# EAGLE design PSU Board (EAGLE 9.0.1)
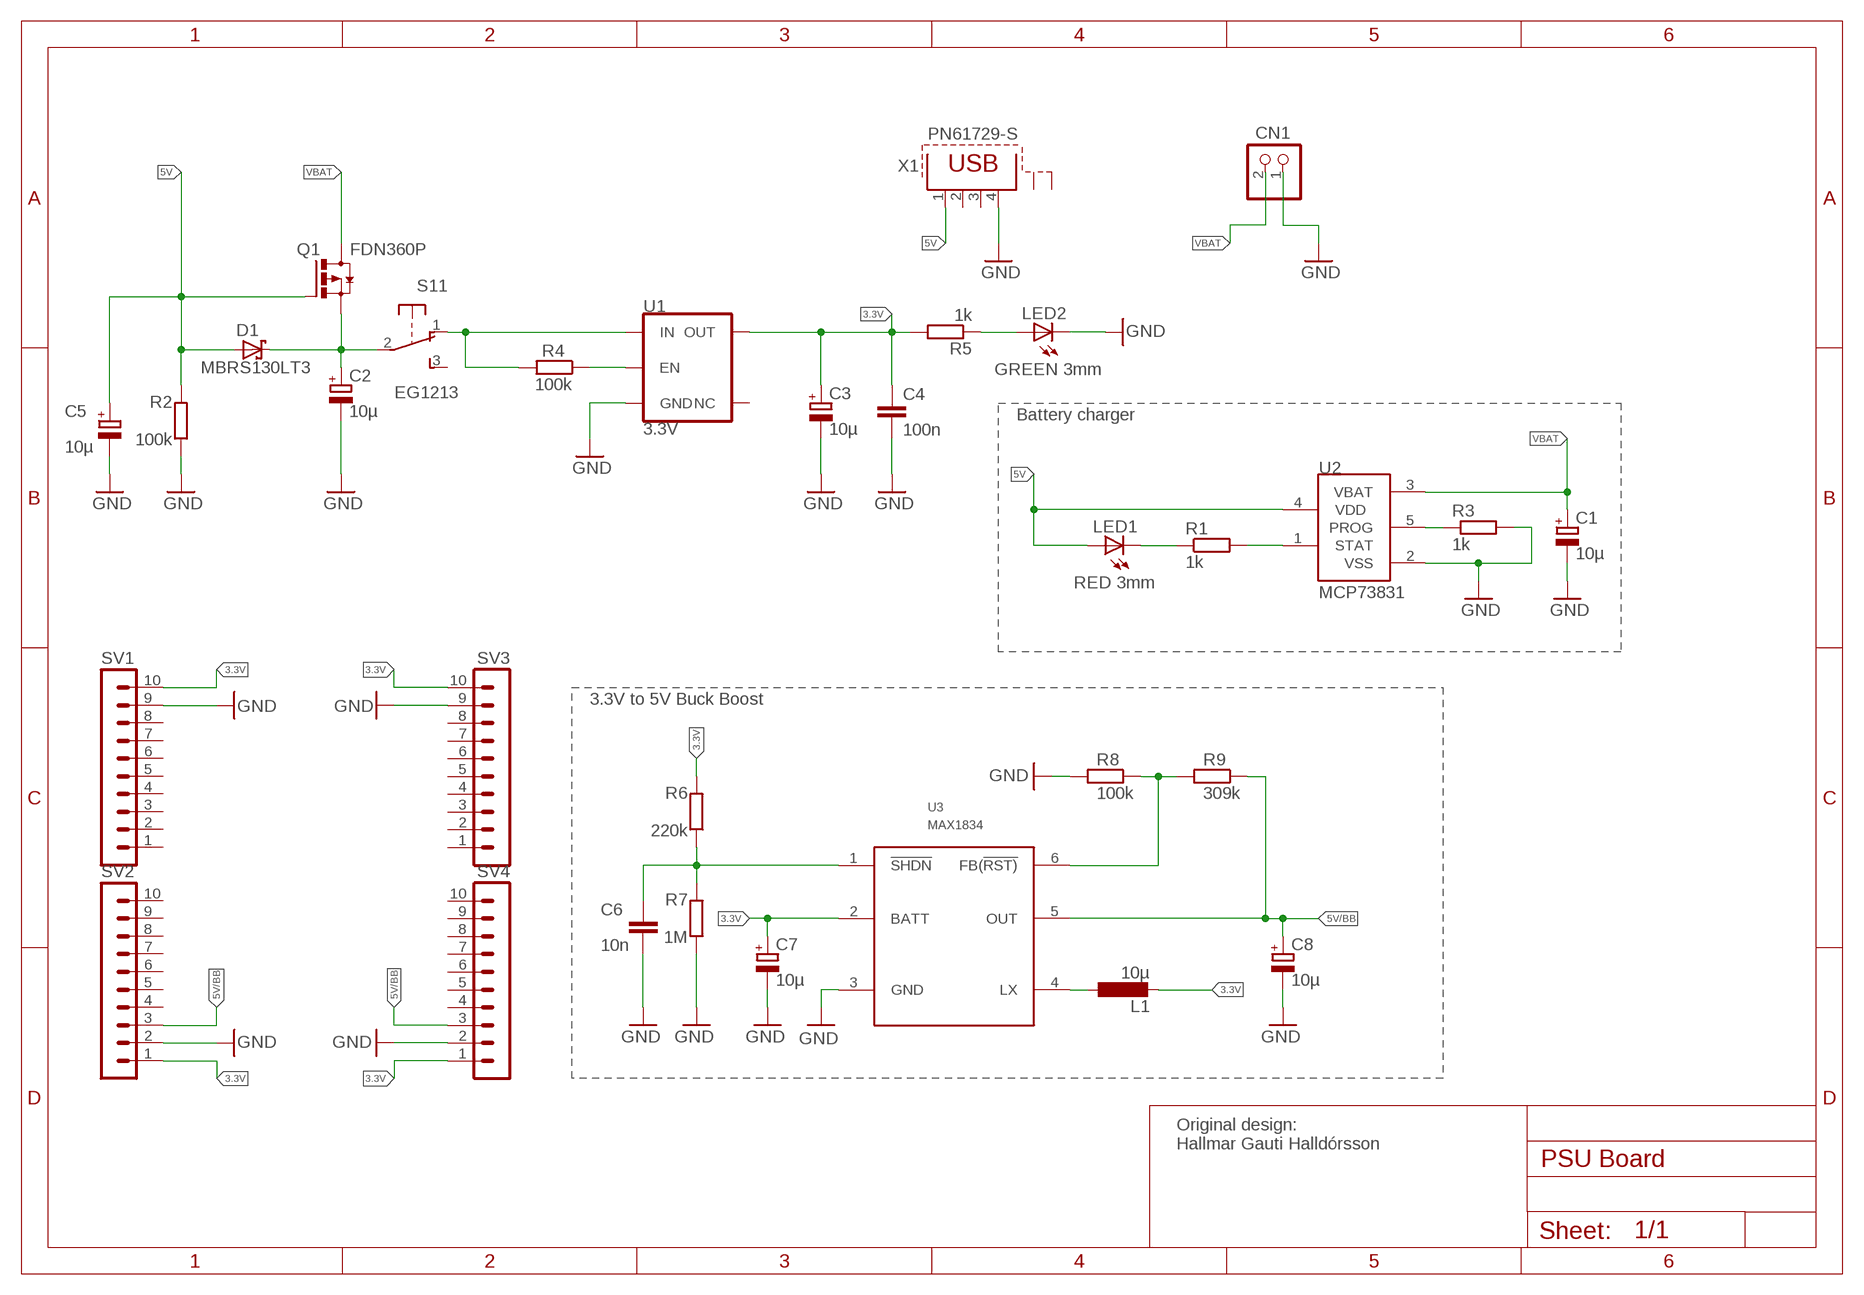
[diagram p0: schematic, sheet 1]

## Parts
C1  10µ  CPOL-EU140CLH-0810  [140CLH-0810]
C2  10µ  CPOL-EU140CLH-0810  [140CLH-0810]
C3  10µ  CPOL-EU140CLH-0810  [140CLH-0810]
C4  100n  C-EUC1206  [C1206]
C5  10µ  CPOL-EU140CLH-0810  [140CLH-0810]
C6  10n  C-EUC1206  [C1206]
C7  10µ  CPOL-EU140CLH-0810  [140CLH-0810]
C8  10µ  CPOL-EU140CLH-0810  [140CLH-0810]
CN1  JST_2PIN-SMT  [JST-PH-2-SMT]
D1  MBRS130LT3  [SMB]
L1  10µ  L-EUL3216C  [L3216C]
LED1  RED 3mm  LED3MM  [LED3MM]
LED2  GREEN 3mm  LED3MM  [LED3MM]
Q1  FDN360P  [SUPER-SOT3]
R1  1k  R-EU_M1206  [M1206]
R2  100k  R-EU_M1206  [M1206]
R3  1k  R-EU_M1206  [M1206]
R4  100k  R-EU_M1206  [M1206]
R5  1k  R-EU_M1206  [M1206]
R6  220k  R-EU_M1206  [M1206]
R7  1M  R-EU_M1206  [M1206]
R8  100k  R-EU_M1206  [M1206]
R9  309k  R-EU_M1206  [M1206]
S1  EG1213  [EG1213]
SV1  MA10-1  [MA10-1]
SV2  MA10-1  [MA10-1]
SV3  MA10-1  [MA10-1]
SV4  MA10-1  [MA10-1]
U1  3.3V  V_REG_AP2112K-3.3V  [SOT23-5]
U2  MCP73831  [SOT23-5L]
U3  MAX1834  [SOT23-6]
X1  PN61729-S  [PN61729-S]

## Nets
3.3V: C3.+ C4.1 C7.+ L1.2 R5.2 R6.2 SV1.10 SV2.1 SV3.10 SV4.1 U1.5(OUT) U3.2(BATT)
5V: C5.+ D1.A LED1.A Q1.1(G) R2.2 U2.4(VDD) X1.1
5V/BB: C8.+ R9.1 SV2.3 SV4.3 U3.5(OUT)
GND: C1.- C2.- C3.- C4.2 C5.- C6.2 C7.- C8.- CN1.1 LED2.K(C) R2.1 R3.2 R7.1 R8.2 SV1.9 SV2.2 SV3.9 SV4.2 U1.2(GND) U2.2(VSS) U3.3(GND) X1.4
N$1: C2.+ D1.C Q1.2(S) S1.2(1:P)
N$2: R1.2 U2.1(STAT)
N$3: R4.2 S1.1(1:O) U1.1(IN)
N$4: LED1.K(C) R1.1
N$5: R3.1 U2.5(PROG)
N$6: R4.1 U1.3(EN)
N$7: LED2.A R5.1
N$8: C6.1 R6.1 R7.2 U3.1(!SHDN)
N$9: L1.1 U3.4(LX)
N$10: R8.1 R9.2 U3.6(FB(!RST))
VBAT: C1.+ CN1.2 Q1.3(D) U2.3(VBAT)
Unconnected: S1.3(1:S) S1.MT1(MT) S1.MT2(MT) SV1.1 SV1.2 SV1.3 SV1.4 SV1.5 SV1.6 SV1.7 SV1.8 SV2.4 SV2.5 SV2.6 SV2.7 SV2.8 SV2.9 SV2.10 SV3.1 SV3.2 SV3.3 SV3.4 SV3.5 SV3.6 SV3.7 SV3.8 SV4.4 SV4.5 SV4.6 SV4.7 SV4.8 SV4.9 SV4.10 U1.4(NC) X1.2 X1.3 X1.S1 X1.S2

## Notes on the sheet
- Battery charger
- 3.3V to 5V Buck Boost
- Original design: 
  Hallmar Gauti Halldórsson

## Library data of the parts
C1-C3 C5 C7 C8 = resistor:CPOL-EU: POLARIZED CAPACITOR, European symbol
C4 C6 = resistor:C-EU: CAPACITOR, European symbol
CN1 = adafruit:JST_2PIN: JST 2-Pin Connectors of various flavors SMT-RA (S2B-PH-SM4) 4UConnector #17311 SMT (B2B-PH-SM4) THM-RA (S2B-PH) THM (B2B-PH)
D1 = diode:MBRS130LT3: Schottky Power Rectifier Source: http://www.onsemi.com/pub/Collateral/MBRS130LT3-D.PDF
L1 = resistor:L-EU: INDUCTOR, European symbol
LED1 LED2 = adafruit:LED: LED OSRAM: - CHIPLED LG R971, LG N971, LY N971, LG Q971, LY Q971, LO R971, LY R971 LH N974, LH R974 LS Q976, LO Q976, LY Q976 LO Q996 - Hyper CHIPLED LW Q18S LB Q993, LB Q99A, LB R99A - SideLED LS A670, LO A670, LY A670, LG A670, LP A670 LB A673, LV A673, LT A673, LW A673 LH A674 LY A675 LS A676, LA A676, LO A676, LY A676, LW A676 LS A679, LY A679, LG A679 - Hyper Micro SIDELED® LS Y876, LA Y876, LO Y876, LY Y876 LT Y87S - SmartLED LW L88C, LW L88S LB L89C, LB L89S, LG L890 LS L89K, LO L89K, LY L89K LS L896, LA L896, LO L896, LY L896 - TOPLED LS T670, LO T670, LY T670, LG T670, LP T670 LSG T670, LSP T670, LSY T670, LOP T670, LYG T670 LG T671, LOG T671, LSG T671 LB T673, LV T673, LT T673, LW T673 LH T674 LS T676, LA T676, LO T676, LY T676, LB T676, LH T676, LSB T676, LW T676 LB T67C, LV T67C, LT T67C, LS T67K, LO T67K, LY T67K, LW E67C LS E67B, LA E67B, LO E67B, LY E67B, LB E67C, LV E67C, LT E67C LW T67C LS T679, LY T679, LG T679 LS T770, LO T770, LY T770, LG T770, LP T770 LB T773, LV T773, LT T773, LW T773 LH T774 LS E675, LA E675, LY E675, LS T675 LS T776, LA T776, LO T776, LY T776, LB T776 LHGB T686 LT T68C, LB T68C - Hyper Mini TOPLED® LB M676 - Mini TOPLED Santana® LG M470 LS M47K, LO M47K, LY M47K Source: http://www.osram.convergy.de/
Q1 = transistor-power:FDN360P: Single P-Channel, PowerTrench (R) MOSFET Source: http://www.fairchildsemi.com/ds/FD/FDN360P.pdf
R1-R9 = resistor:R-EU_: RESISTOR, European symbol
S1 = adafruit:EG1213: E-Switch right-angle slide SPDT Part #EG1213 http://www.ladyada.net/library/eagle
SV1-SV4 = con-lstb:MA10-1: PIN HEADER; OC_FARNELL: unknown; OC_NEWARK: unknown
U1 = SparkFun-IC-Power:V_REG_AP2112: AP2112 - 600mA CMOS LDO Regulator w/ Enable The AP2112 is CMOS process low dropout linear regulator with enable function, the regulator delivers a guaranteed 600mA (min.) continuous load current. Features Output Voltage Accuracy: ±1.5% Output Current: 600mA (Min.) Foldback Short Current Protection: 50mA Enable Function to Turn ON/OFF VOUT Low Dropout Voltage (3.3V): 250mV (Typ.) @IOUT=600mA Excellent Load Regulation: 0.2%/A (Typ.) Excellent Line Regulation: 0.02%/V (Typ.) Low Quiescent Current: 55μA (Typ.) Low Standby Current: 0.01μA (Typ.) Low Output Noise: 50μVRMS PSRR: 100Hz -65dB, 1kHz -65dB OTSD Protection Stable with 1.0μF Flexible Cap: Ceramic, Tantalum and Aluminum Electrolytic Operation Temperature Range: -40°C to 85°C ESD: MM 400V, HBM 4000V; PROD_ID: VREG-12457
U2 = mcp73831:MCP73831: Miniature Single-Cell, Fully Integrated Li-Ion, Li-Polymer Charge Management Controllers
U3 = hallmar-lib:MAX1834
X1 = con-berg:PN61729-S: BERG USB connector; OC_FARNELL: unknown; OC_NEWARK: unknown

## Board
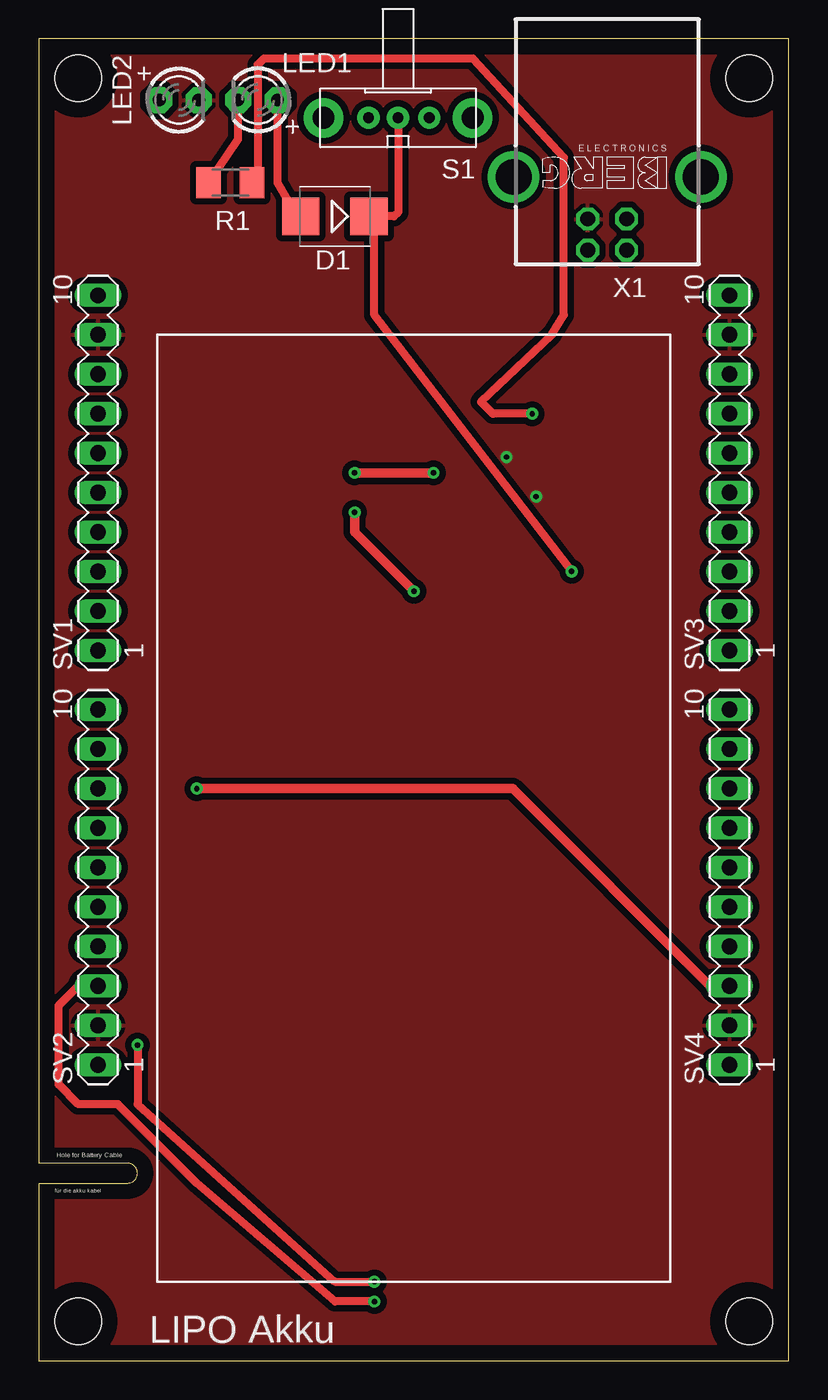
[diagram p1: board, top side]
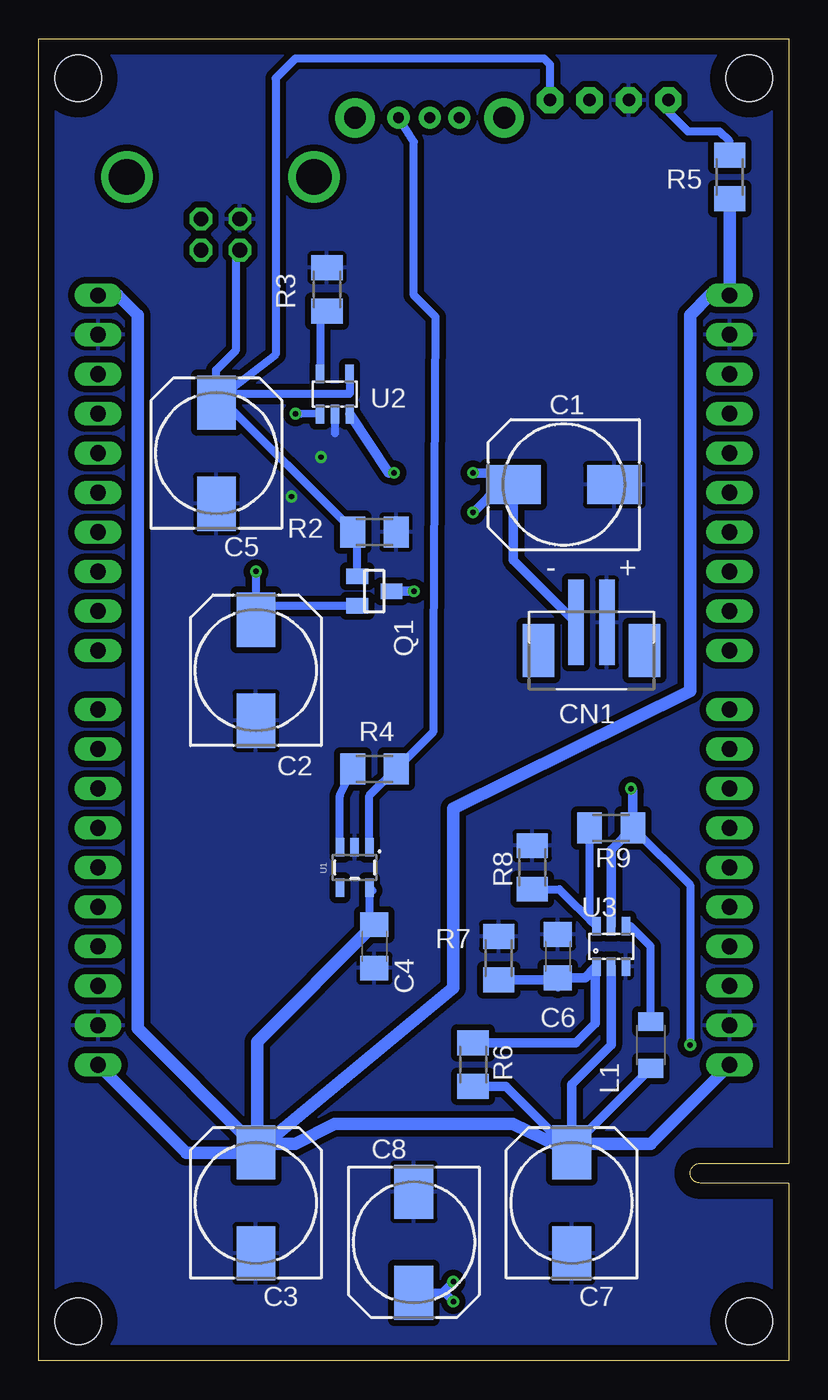
[diagram p2: board, bottom side, seen from below]

Size 48.26 x 85.09 mm. Coordinates in mm from the lower left corner, seen from the top.
Outline: 0,0 48.26,0 48.26,85.09 0,85.09 0,12.7 5.71,12.7 arc-90 6.35,12.06 arc-90 5.71,11.43 0,11.43 0,0
Copper layers (1*16): Top 0.035mm / dielectric 1.5mm / Bottom 0.035mm
Design rules "default": minimum track width 6mil, minimum drill 0.35mm, track to track 6mil, track to pad 6mil, pad to pad 6mil, via to via 6mil, smd to smd 6mil, copper to edge 40mil, drill to drill 6mil, minimum pad ring 10mil, minimum via ring 8mil, stop-mask expansion 4mil, vias tented up to drill 0mil, thermal gap 10mil
Holes 3 mm at 2.54,82.55 45.72,82.55 2.54,2.54 45.72,2.54

### Footprints (pad centres in the part's own frame; a part is rotated, then mirrored left to right if it is on the bottom)
140CLH-0810 = smd 3.5 x 2.5: + 3.25,0; - -3.25,0
C1206 = smd 1.6 x 1.8: 1 -1.4,0; 2 1.4,0
JST-PH-2-SMT = smd 1 x 5.5: 1 -1,-1.8; 2 1,-1.8 | smd 1.6 x 3.4: NC1 -3.4,0 | smd 2.032 x 3.4: NC2 3.4,0; NC3 -3.4,0
SMB = smd 2.4 x 2.4: A 2.2,0; C -2.2,0
L3216C = smd 1.2 x 1.6: 1 -1.5,0; 2 1.5,0
LED3MM = drill 0.813 pad 1.676 octagon: A -1.27,0; K 1.27,0
SUPER-SOT3 = smd 1 x 1.4: 1 -0.95,-1.1; 2 0.95,-1.1; 3 0,1.1
M1206 = smd 1.6 x 2: 1 -1.4,0; 2 1.4,0
EG1213 = drill 0.7 pad 1.422: 1 -2,0; 2 0,0; 3 1.9,0 | drill 1.4 pad 2.54: MT1 -4.8,0; MT2 4.8,0
MA10-1 = drill 1.016 long: 1 -11.43,0; 2 -8.89,0; 3 -6.35,0; 4 -3.81,0; 5 -1.27,0; 6 1.27,0; 7 3.81,0; 8 6.35,0; 9 8.89,0; 10 11.43,0
SOT23-5 = smd 0.55 x 1.2: 1 -0.95,-1.3; 2 0,-1.3; 3 0.95,-1.3; 4 0.95,1.3; 5 -0.95,1.3
SOT23-5L = smd 0.533 x 1.2: 1 -0.95,-1.3; 2 0,-1.3; 3 0.95,-1.3 | smd 0.55 x 1.2: 4 0.95,1.3; 5 -0.95,1.3
SOT23-6 = smd 0.55 x 1.2: 1 -0.95,-1.3; 2 0,-1.3; 3 0.95,-1.3; 4 0.95,1.3; 5 0,1.3; 6 -0.95,1.3
PN61729-S = drill 0.95 octagon: 1 1.25,4.71; 2 -1.25,4.71; 3 -1.25,2.71; 4 1.25,2.71 | drill 2.3 pad 2.9: S1 -6.02,0; S2 6.02,0

### Placement (x,y rotation side)
C1  14.48,56.39 180 bottom
C2  34.29,44.45 90 bottom
C3  34.29,10.16 90 bottom
C4  26.67,26.67 270 bottom
C5  36.83,58.42 90 bottom
C6  14.86,26.04 90 bottom
C7  13.97,10.16 90 bottom
C8  24.13,7.62 270 bottom
CN1  12.7,45.72 180 bottom
D1  19.05,73.66 180 top
L1  8.89,20.32 270 bottom
LED1  14.1,81.15 180 top
LED2  9.02,81.15 0 top
Q1  26.67,49.53 270 bottom
R1  12.32,75.82 0 top
R2  26.67,53.34 180 bottom
R3  29.72,68.96 90 bottom
R4  26.67,38.1 0 bottom
R5  3.81,76.2 270 bottom
R6  20.32,19.05 270 bottom
R7  18.67,25.91 270 bottom
R8  16.51,31.75 90 bottom
R9  11.43,34.29 180 bottom
S1  23.11,80.01 180 top
SV1  3.81,57.15 90 top
SV2  3.81,30.48 90 top
SV3  44.45,57.15 90 top
SV4  44.45,30.48 90 top
U1  27.94,31.75 180 bottom
U2  29.21,62.23 0 bottom
U3  11.43,26.67 0 bottom
X1  36.58,76.2 180 top

### Tracks (layer width: path | path; a pad name or v marks a point on that pad's centre or on a via)
3.3V
  Bottom 0.508: 26.8,30.26 U1.5 26.99,28.39 C4.1
  Bottom 0.61: L1.2 13.97,13.74 | U3.2 11.43,20.32 13.97,17.78 C7.+ 18.21,17.65 R6.2
  Bottom 0.813: C3.+ 33.73,13.97 31.75,13.97 29.21,15.24 17.78,15.24 C7.+ | C7.+ 13.97,12.7 | 13.97,13.74 C7.+ | 34.77,13.41 35,13.41 | C3.+ 34.42,13.54 34.22,13.93 34.22,20.52 C4.1 | C3.+ 34.77,13.41 | 34.77,13.41 34.39,13.36 | 34.39,13.36 22.15,23.54 21.59,24 21.59,35.56 6.35,43.1 6.35,67.31 5.08,68.58 SV1.10 R5.2 | C3.+ 34.45,13.92 41.91,21.38 41.91,67.31 43.18,68.58 SV3.10 | C7.+ 13.26,13.97 8.89,13.97 SV2.1 | SV4.1 38.76,13.36 34.39,13.36
5V
  Top 0.508: D1.A 16.51,73.91 15.37,75.82 LED1.A
  Bottom 0.152: R2.2 27.94,53.34 27.77,53.17 | C5.+ 36.83,62.23
  Bottom 0.508: LED1.A 15.37,83.44 15.75,83.82 31.75,83.82 33.02,82.55 33.02,64.77 36.32,62.23 | 35.19,71.49 X1.1 35.56,71.37 35.56,65.06 36.85,63.77 36.83,62.23 | Q1.1 27.77,53.17 36.83,62.23 | U2.4 28.26,62.23 36.32,62.23 | 36.32,62.23 36.83,62.23
  Bottom 0.61: C5.+ 37.39,62.23
5V/BB  (via drill 0.35)
  Top 0.508: v6.35,20.32 6.35,16.51 19.05,5.08 v21.59,5.08 | v21.59,3.81 19.05,3.81 10.16,11.43 5.08,16.51 2.54,16.51 1.27,17.78 1.27,22.86 2.54,24.13 SV2.3
  Top 0.61: v10.16,36.83 30.48,36.83 43.18,24.13 SV4.3
  Bottom 0.508: R9.1 6.35,30.61 v6.35,20.32 | v21.59,5.08 22.3,4.37 C8.+ 22.15,4.37 v21.59,3.81
  Bottom 0.61: U3.5 11.43,32.89 R9.1 10.03,36.7 v10.16,36.83
GND  (via drill 0.35)
  Bottom 0.508: U2.2 29.21,59.69
  other vias: 30.1,58.17 32,55.63
  pour Bottom (isolate 0.406): 0,85.09 48.26,85.09 48.26,0 0,0
  pour Top (isolate 0.406): 0,85.09 48.26,85.09 48.26,0 0,0
N$1  (via drill 0.35)
  Top 0.508: v34.29,50.8 21.59,67.31 21.59,73.66 | 21.59,73.66 D1.C | S1.2 23.11,73.91 22.86,73.66 21.59,73.66
  Bottom 0.508: Q1.2 33.34,48.58 34.29,48.26 | 34.29,48.26 C2.+ | v34.29,50.8 34.29,48.26
N$2  (via drill 0.35)
  Top 0.508: v31.75,60.96 29.21,60.96 28.45,61.72 33.02,66.04 33.78,67.31 33.78,77.47 27.94,83.82 14.48,83.82 14.08,83.42 14.08,76.44 R1.2
  Bottom 0.508: U2.1 31.43,60.96 v31.75,60.96
N$3
  Bottom 0.508: U1.1 26.99,36.38 R4.2 22.86,40.51 22.86,45.72 22.73,67.18 24.13,68.58 24.13,78.45 S1.1
N$4
  Top 0.508: R1.1 12.83,78.62 LED1.K
N$5
  Bottom 0.508: R3.1 30.16,67.12 U2.5
N$6
  Bottom 0.508: U1.3 28.89,36.38 R4.1
N$7
  Bottom 0.152: R5.1 3.81,77.47
  Bottom 0.508: LED2.A 7.75,80.39 6.48,79.12 4.45,79.12 3.81,78.49 3.81,77.47
N$8
  Bottom 0.508: C6.1 14.86,24
  Bottom 0.61: R7.2 14.99,24.51 C6.1 13.12,24.64 12.45,25.3 | R6.1 13.71,20.45 12.45,21.72 12.45,25.3 | 12.45,25.3 U3.1
N$9
  Bottom 0.508: L1.1 8.89,26.67 10.19,27.97 U3.4
N$10
  Bottom 0.508: R9.2 12.83,28.42 U3.6 14.76,30.35 R8.1
VBAT  (via drill 0.35)
  Top 0.61: v24.13,49.53 20.32,53.34 v20.32,54.61 | v20.32,57.15 v25.4,57.15
  Bottom 0.406: v25.4,57.15 25.75,57.15 | 18.54,56.39 C1.+
  Bottom 0.508: 18.49,57.15 C1.+
  Bottom 0.61: v20.32,57.15 18.49,57.15 | C1.+ 17.73,51.55 CN1.2 | v24.13,49.53 Q1.3 | 25.75,57.15 U2.3 | v20.32,54.61 18.54,56.39

### Text on the board
tPlace: Hole for Battery Cable | LIPO Akku
tNames: für die akku kabel